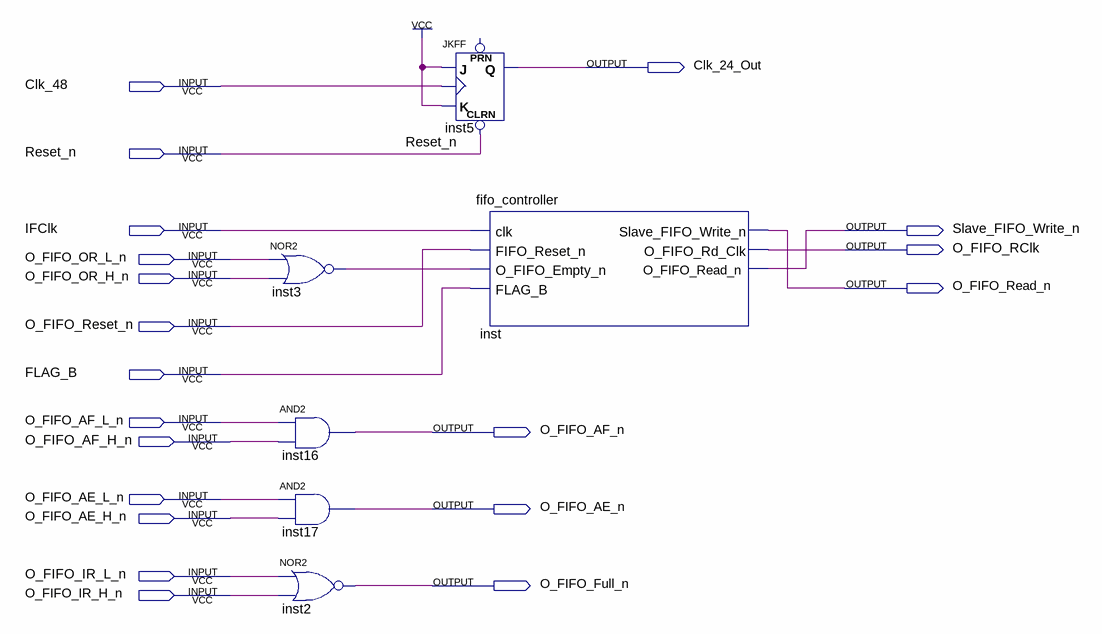
[diagram p0: schematic sheet]
// Quartus schematic FIFO_Control_Module.bdf as structural Verilog: 6 symbols, 20 pins
module FIFO_Control_Module (
  input  Clk_48,
  input  Reset_n,
  input  IFClk,
  input  O_FIFO_OR_L_n,
  input  O_FIFO_OR_H_n,
  input  O_FIFO_Reset_n,
  input  FLAG_B,
  input  O_FIFO_AF_L_n,
  input  O_FIFO_AF_H_n,
  input  O_FIFO_AE_L_n,
  input  O_FIFO_AE_H_n,
  input  O_FIFO_IR_L_n,
  input  O_FIFO_IR_H_n,
  output Clk_24_Out,
  output Slave_FIFO_Write_n,
  output O_FIFO_RClk,
  output O_FIFO_Read_n,
  output O_FIFO_AF_n,
  output O_FIFO_AE_n,
  output O_FIFO_Full_n
);

  wire inst3_out;

  nor inst3 (inst3_out, O_FIFO_OR_L_n, O_FIFO_OR_H_n);
  and inst16 (O_FIFO_AF_n, O_FIFO_AF_L_n, O_FIFO_AF_H_n);
  and inst17 (O_FIFO_AE_n, O_FIFO_AE_L_n, O_FIFO_AE_H_n);
  nor inst2 (O_FIFO_Full_n, O_FIFO_IR_L_n, O_FIFO_IR_H_n);
  JKFF inst5 (.CLRN(Reset_n), .K(1'b1), .J(1'b1), .CLK(Clk_48), .Q(Clk_24_Out));  // open: PRN
  fifo_controller inst (
    .clk(IFClk), .FIFO_Reset_n(O_FIFO_Reset_n), .O_FIFO_Empty_n(inst3_out), .FLAG_B(FLAG_B),
    .Slave_FIFO_Write_n(O_FIFO_Read_n), .O_FIFO_Rd_Clk(O_FIFO_RClk), .O_FIFO_Read_n(Slave_FIFO_Write_n));
endmodule
